# EAGLE schematic obvod (EAGLE 7.7.0)
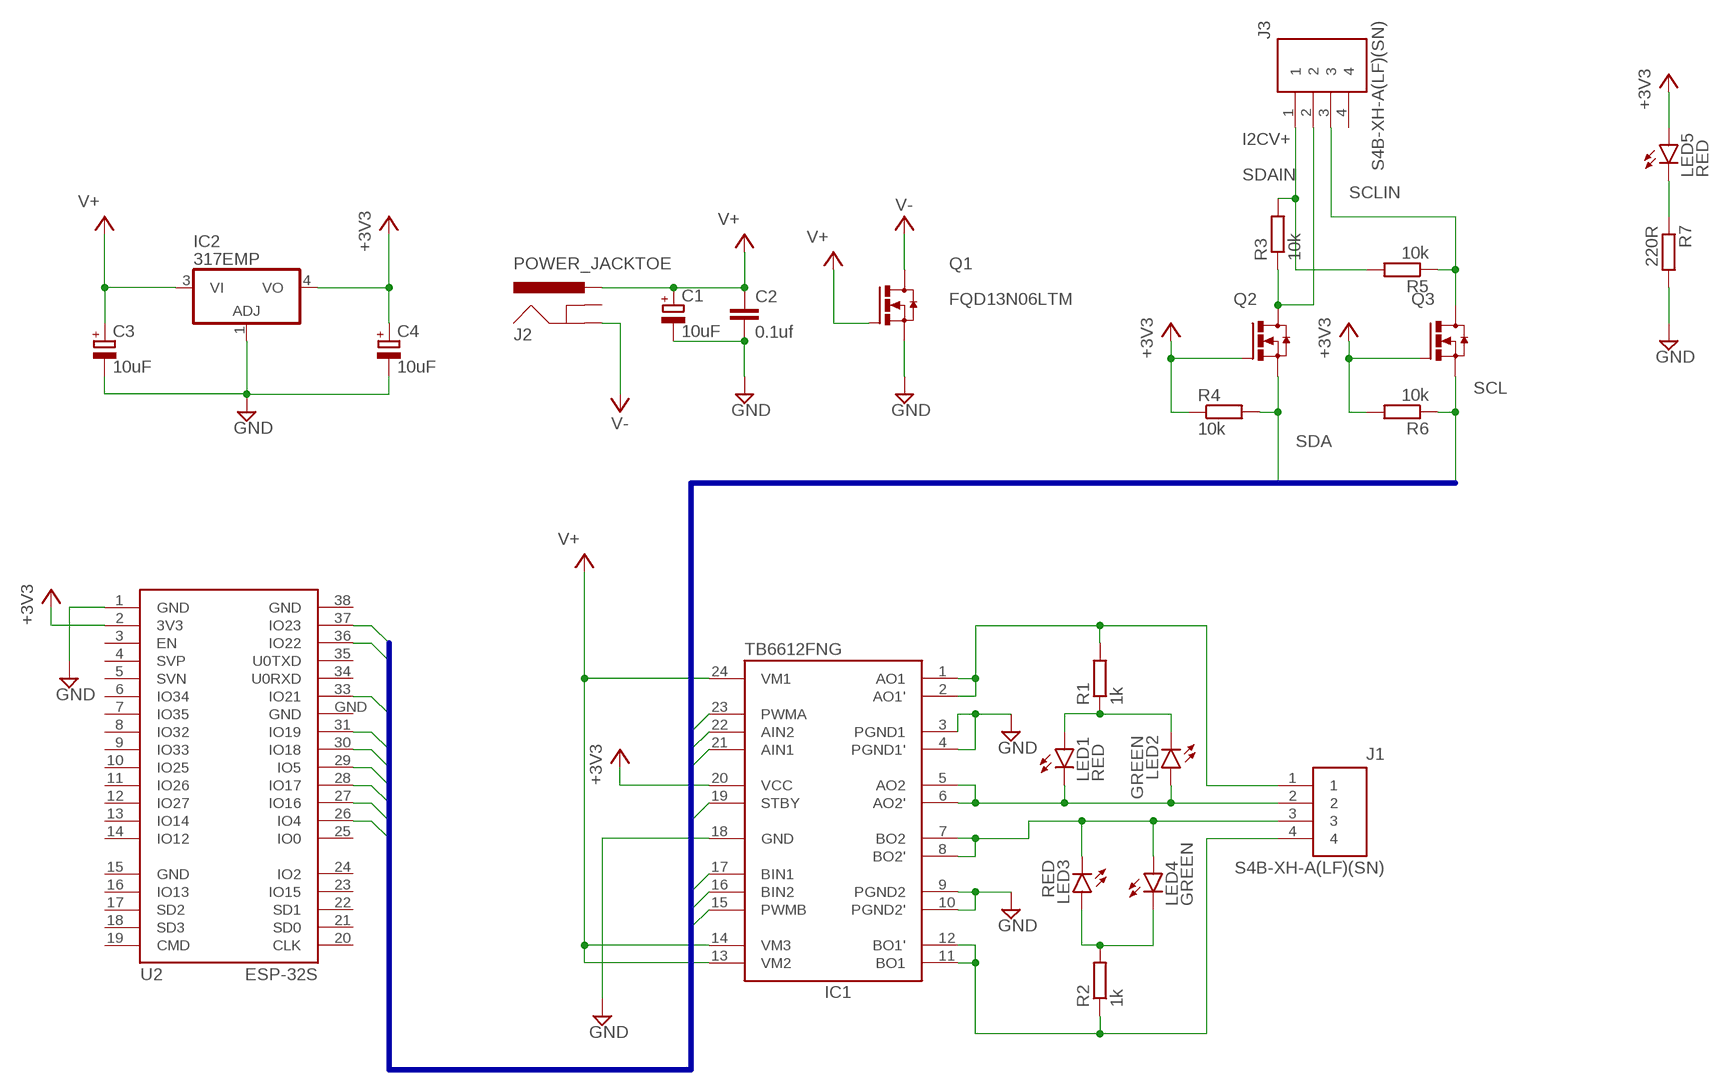
[diagram p0: schematic, sheet 1]

## Parts
C1  10uF  CPOL-EU153CLV-0605  [153CLV-0605]
C2  0.1uf  C-EUC0805  [C0805]
C3  10uF  CPOL-EUSMCC  [SMC_C]
C4  10uF  CPOL-EUSMCC  [SMC_C]
IC1  TB6612FNG  [SSOP24]
IC2  317EMP  [SOT223]
J1  S4B-XH-A(LF)(SN)  [HDR-04/RA]
J2  POWER_JACKTOE  [POWER_JACK_SMD_OVERPASTE_TOE]
J3  S4B-XH-A(LF)(SN)  [HDR-04/RA]
LED1  RED  LEDCHIPLED_0805  [CHIPLED_0805]
LED2  GREEN  LEDCHIPLED_0805  [CHIPLED_0805]
LED3  RED  LEDCHIPLED_0805  [CHIPLED_0805]
LED4  GREEN  LEDCHIPLED_0805  [CHIPLED_0805]
LED5  RED  LEDCHIPLED_0805  [CHIPLED_0805]
Q1  FQD13N06LTM  [DPAK3]
Q2  2N7002,215  [SOT23-3]
Q3  2N7002,215  [SOT23-3]
R1  1k  R-EU_R0805  [R0805]
R2  1k  R-EU_R0805  [R0805]
R3  10k  R-EU_R0805  [R0805]
R4  10k  R-EU_R0805  [R0805]
R5  10k  R-EU_R0805  [R0805]
R6  10k  R-EU_R0805  [R0805]
R7  220R  R-EU_R0805  [R0805]
U2  ESP-32S  [ESP-32S]

## Nets
+3V3: C4.+ IC1.20(VCC) IC2.4(VO) LED5.A Q2.1(G) Q3.1(G) R4.1 R6.2 U2.2(3V3)
AIN1: IC1.21(AIN1) U2.30(IO18)
AIN2: IC1.22(AIN2) U2.29(IO5)
BIN1: IC1.17(BIN1) U2.33(IO21)
BIN2: IC1.16(BIN2) U2.36(IO22)
GND: C1.- C2.2 C3.- C4.- IC1.3(PGND1) IC1.4(PGND1') IC1.9(PGND2) IC1.10(PGND2') IC1.18(GND) IC2.1(ADJ) Q1.2(S) R7.2 U2.1(GND)
I2CV+: J3.1 R3.2 R5.2
N$1: IC1.1(AO1) IC1.2(AO1') J1.1 R1.2
N$2: IC1.5(AO2) IC1.6(AO2') J1.2 LED1.C LED2.A
N$3: IC1.7(BO2) IC1.8(BO2') J1.3 LED3.C LED4.A
N$4: IC1.11(BO1) IC1.12(BO1') J1.4 R2.1
N$5: LED1.A LED2.C R1.1
N$6: LED3.A LED4.C R2.2
N$7: LED5.C R7.1
PWMA: IC1.23(PWMA) U2.28(IO17)
PWMB: IC1.15(PWMB) U2.37(IO23)
SCL: Q3.2(S) R6.1 U2.27(IO16)
SCLIN: J3.3 Q3.3(D) R5.1
SDA: Q2.2(S) R4.2 U2.26(IO4)
SDAIN: J3.2 Q2.3(D) R3.1
STBY: IC1.19(STBY) U2.31(IO19)
V+: C1.+ C2.1 C3.+ IC1.13(VM2) IC1.14(VM3) IC1.24(VM1) IC2.3(VI) J2.VIN0(PWR) Q1.1(G)
V-: J2.P$4(GND) Q1.3(D)
Unconnected: J2.GND(GNDBREAK) J3.4 U2.3(EN) U2.4(SVP) U2.5(SVN) U2.6(IO34) U2.7(IO35) U2.8(IO32) U2.9(IO33) U2.10(IO25) U2.11(IO26) U2.12(IO27) U2.13(IO14) U2.14(IO12) U2.16(IO13) U2.17(SD2) U2.18(SD3) U2.19(CMD) U2.20(CLK) U2.21(SD0) U2.22(SD1) U2.23(IO15) U2.24(IO2) U2.25(IO0) U2.34(U0RXD) U2.35(U0TXD)

## Buses
AIN1,AIN2,BIN1,BIN2,PWMA,PWMB,SCL,SDA,STBY

## Power pins joined to a net without a drawn wire
GND: U2.15(GND) U2.38(GND) U2.GND

## Library data of the parts
C1 C3 C4 = rcl:CPOL-EU: POLARIZED CAPACITOR, European symbol; SPICEPREFIX: C
C2 = rcl:C-EU: CAPACITOR, European symbol; SPICEPREFIX: C
IC1 = adafruit:TB6612FNG: TB6612FNG MOS dual H-bridge motor driver, 1.2A current 3.2A peak 3 or 5v logic and 3-15v motor
IC2 = linear:*317: Positive VOLTAGE REGULATOR
J1 J3 = Connectors:S4B-XH-A(LF)(SN): CONN HEADER R/A 4POS 2.5MM Manufacturer's datasheet <http://www.jst-mfg.com/product/pdf/eng/eXH.pdf>; CREATED_BY: PCBLayout.com; DIGIKEY_PART_NUMBER: 455-2243-ND; MANUFACTURER: JST Sales America Inc.; MPN: S4B-XH-A(LF)(SN)
J2 = SparkFun-Connectors:POWER_JACK: Power Jack Connector This is the standard 5.5mm barrel jack for power. The PTH is the most common, proven, reliable, footprint. The Slot footprint only works if the mill layer is transmitted to the PCB fab house so be warned. Here are the connectors we sell at SparkFun: DC Barrel Power Jack/Connector <https://www.sparkfun.com/products/119> (PRT-00119) DC Barrel Power Jack/Connector (SMD) <https://www.sparkfun.com/products/12748> (PRT-12748) DC Barrel Jack Adapter - Breadboard Compatible <https://www.sparkfun.com/products/10811> (PRT-10811) It is used on this SparkFun product (and many, many others): SparkFun RedBoard - Programmed with Arduino <https://www.sparkfun.com/products/12757> (DEV-12757) Also, if you need a mating power supply or connector, please check these out: Wall Adapter Power Supply - 9VDC 650mA <https://www.sparkfun.com/products/298> (TOL-00298) DC Barrel Jack Adapter - Male <https://www.sparkfun.com/products/10287> (PRT-10287); PROD_ID: CONN-08106; SF_ID: PRT-12748
LED1-LED5 = led:LED: LED OSRAM: - CHIPLED LG R971, LG N971, LY N971, LG Q971, LY Q971, LO R971, LY R971 LH N974, LH R974 LS Q976, LO Q976, LY Q976 LO Q996 - Hyper CHIPLED LW Q18S LB Q993, LB Q99A, LB R99A - SideLED LS A670, LO A670, LY A670, LG A670, LP A670 LB A673, LV A673, LT A673, LW A673 LH A674 LY A675 LS A676, LA A676, LO A676, LY A676, LW A676 LS A679, LY A679, LG A679 - Hyper Micro SIDELED® LS Y876, LA Y876, LO Y876, LY Y876 LT Y87S - SmartLED LW L88C, LW L88S LB L89C, LB L89S, LG L890 LS L89K, LO L89K, LY L89K LS L896, LA L896, LO L896, LY L896 - TOPLED LS T670, LO T670, LY T670, LG T670, LP T670 LSG T670, LSP T670, LSY T670, LOP T670, LYG T670 LG T671, LOG T671, LSG T671 LB T673, LV T673, LT T673, LW T673 LH T674 LS T676, LA T676, LO T676, LY T676, LB T676, LH T676, LSB T676, LW T676 LB T67C, LV T67C, LT T67C, LS T67K, LO T67K, LY T67K, LW E67C LS E67B, LA E67B, LO E67B, LY E67B, LB E67C, LV E67C, LT E67C LW T67C LS T679, LY T679, LG T679 LS T770, LO T770, LY T770, LG T770, LP T770 LB T773, LV T773, LT T773, LW T773 LH T774 LS E675, LA E675, LY E675, LS T675 LS T776, LA T776, LO T776, LY T776, LB T776 LHGB T686 LT T68C, LB T68C - Hyper Mini TOPLED® LB M676 - Mini TOPLED Santana® LG M470 LS M47K, LO M47K, LY M47K Source: http://www.osram.convergy.de LUXEON: - LUMILED® LXK2-PW12-R00, LXK2-PW12-S00, LXK2-PW14-U00, LXK2-PW14-V00 LXK2-PM12-R00, LXK2-PM12-S00, LXK2-PM14-U00 LXK2-PE12-Q00, LXK2-PE12-R00, LXK2-PE12-S00, LXK2-PE14-T00, LXK2-PE14-U00 LXK2-PB12-K00, LXK2-PB12-L00, LXK2-PB12-M00, LXK2-PB14-N00, LXK2-PB14-P00, LXK2-PB14-Q00 LXK2-PR12-L00, LXK2-PR12-M00, LXK2-PR14-Q00, LXK2-PR14-R00 LXK2-PD12-Q00, LXK2-PD12-R00, LXK2-PD12-S00 LXK2-PH12-R00, LXK2-PH12-S00 LXK2-PL12-P00, LXK2-PL12-Q00, LXK2-PL12-R00 Source: www.luxeon.com KINGBRIGHT: KA-3528ASYC Source: www.kingbright.com
Q1 = Transistor:FQD13N06LTM: MOSFET N-CH 60V 11A DPAK Manufacturer's datasheet <https://www.onsemi.com/pub/Collateral/FQU13N06L-D.PDF>; CREATED_BY: PCBLayout.com; DIGIKEY_PART_NUMBER: FQD13N06LTMCT-ND; MANUFACTURER: ON Semiconductor; MPN: FQD13N06LTM; PACKAGE: DPAK-4
Q2 Q3 = Transistor:2N7002,215: MOSFET N-CH 60V 300MA SOT-23 Manufacturer's datasheet <https://assets.nexperia.com/documents/data-sheet/2N7002.pdf>; CREATED_BY: PCBLayout.com; DIGIKEY_PART_NUMBER: 1727-2764-1-ND; MANUFACTURER: Nexperia USA Inc.; MPN: 2N7002,215; PACKAGE: SOT-23-3
R1-R7 = rcl:R-EU_: RESISTOR, European symbol; SPICEPREFIX: R
U2 = esp32:ESP-32S: Ai-Thinker ESP-32S